# EAGLE schematic schemate (EAGLE 9.1.3)
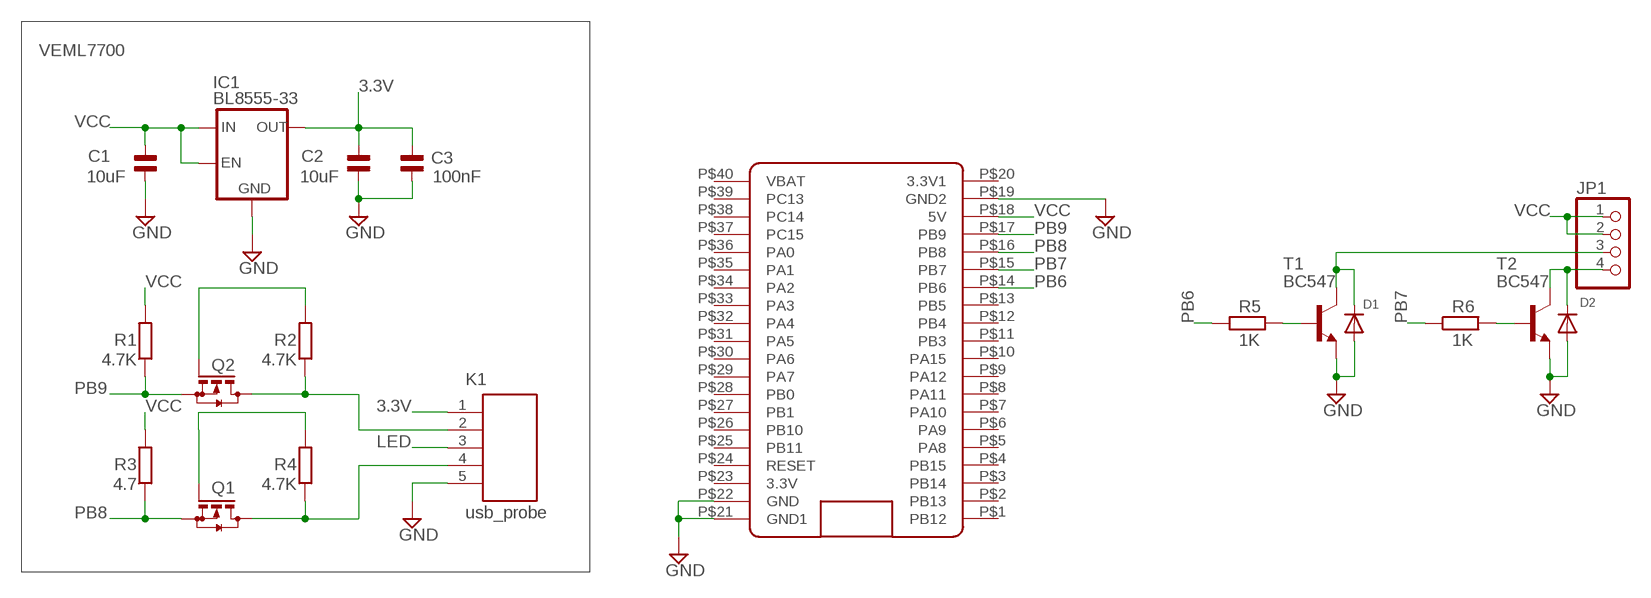
[diagram p0: schematic, sheet 1]

## Parts
C1  10uF  C-NP-SMD-0805  [C-0805]
C2  10uF  C-NP-SMD-0805  [C-0805]
C3  100nF  C-NP-SMD-0805  [C-0805]
D1  DIODESOD-123  [SOD-123]
D2  DIODESOD-123  [SOD-123]
IC1  BL8555-33  TPS70928DBV  [SOT23-5]
JP1  PINHD-1X4  [1X04]
K1  usb_probe  629105136821  [629105136821]
Q1  BSS123  [SOT23]
Q2  BSS123  [SOT23]
R1  4.7K  R-EU_M0805  [M0805]
R2  4.7K  R-EU_M0805  [M0805]
R3  4.7  R-EU_M0805  [M0805]
R4  4.7K  R-EU_M0805  [M0805]
R5  1K  R-EU_0204/7  [0204/7]
R6  1K  R-EU_0204/7  [0204/7]
T1  BC547  [TO92]
T2  BC547  [TO92]
U$1  BLUE_PILL  [BLUE_PILL]

## Nets
3.3V: C2.2 C3.2 IC1.5(OUT) K1.1 K1.2 Q2.3(D) R2.1
GND: C1.1 C2.1 C3.1 D1.A D2.A IC1.2(GND) K1.5 T1.1(E) T2.1(E) U$1.P$19(GND2) U$1.P$21(GND1) U$1.P$22(GND)
LED: K1.3
N$1: D2.C JP1.4 T2.3(C)
N$2: Q1.1(G) R4.2
N$3: D1.C JP1.3 T1.3(C)
N$4: R6.2 T2.2(B)
N$5: Q2.1(G) R2.2
N$6: R5.2 T1.2(B)
PB6: R5.1 U$1.P$14(PB6)
PB7: R6.1 U$1.P$15(PB7)
PB8: Q1.2(S) R3.1 U$1.P$16(PB8)
PB9: Q2.2(S) R1.1 U$1.P$17(PB9)
SDA: K1.4 Q1.3(D) R4.1
VCC: C1.2 IC1.1(IN) IC1.3(EN) JP1.1 JP1.2 R1.2 R3.2 U$1.P$18(5V)
Unconnected: U$1.P$1(PB12) U$1.P$2(PB13) U$1.P$3(PB14) U$1.P$4(PB15) U$1.P$5(PA8) U$1.P$6(PA9) U$1.P$7(PA10) U$1.P$8(PA11) U$1.P$9(PA12) U$1.P$10(PA15) U$1.P$11(PB3) U$1.P$12(PB4) U$1.P$13(PB5) U$1.P$20(3.3V1) U$1.P$23(3.3V) U$1.P$24(RESET) U$1.P$25(PB11) U$1.P$26(PB10) U$1.P$27(PB1) U$1.P$28(PB0) U$1.P$29(PA7) U$1.P$30(PA6) U$1.P$31(PA5) U$1.P$32(PA4) U$1.P$33(PA3) U$1.P$34(PA2) U$1.P$35(PA1) U$1.P$36(PA0) U$1.P$37(PC15) U$1.P$38(PC14) U$1.P$39(PC13) U$1.P$40(VBAT)

## Notes on the sheet
- VEML7700

## Library data of the parts
C1-C3 = cap-pan40:C-NP: NON-POLARIZED FILM/CHIP
D1 D2 = adafruit:DIODE: Diode SMADIODE - SMA Surface Mount Package 20V 1A Schottky Diode Digikey: 641-1014-6-ND DO-1N4148 - Through Hole Small Current Diode SOD-123 20V 1 A (.5mV Vf) Schottky Diode - Digikey: MBRX120TPMSCT-ND SOD-323 10V 570mA (.38mV Vf, 3ns) Schottky Diode - Digikey: ZLLS410CT-ND SOD-523 30V 30mA Schottky Diode (RB751S-40TE61) - Digikey: RB751S-40TE61CT-ND SOT23-R/W - SOT23 Package (R = Solder Paste/Reflow Ovens, W = Hand-Soldering) BAT54Film 40V 300mA - Digikey: 497-7162-1-ND
IC1 = tps709xx_10:TPS709*: TPS709xx 150-mA, 30-V, 1-μA IQ Voltage Regulators with Enable Source: http://www.ti.com/lit/ds/symlink/tps709.pdf; MF: Texas Instruments; MPN: TPS70928DBVT; OC_FARNELL: 2314373; OC_NEWARK: 69W6897
JP1 = pinhead:PINHD-1X4: PIN HEADER
K1 = Wuerth_Elektronik_eiCan_Communication_Connectors_v2.2:629105136821: WR-COM SMT Horizontal 5 Contacts Micro USB Type B,5 pins
Q1 Q2 = transistor-small-signal:BSS123: N-CHANNEL MOS FET
R1-R4 = resistor:R-EU_: RESISTOR, European symbol
R5 R6 = rcl:R-EU_: RESISTOR, European symbol; SPICEPREFIX: R
T1 T2 = transistor-neu-to92:BC547: NPN TRANSISTOR
U$1 = BluePill:BLUE_PILL